# EAGLE design APDS-Breakout (EAGLE 7.2.0)
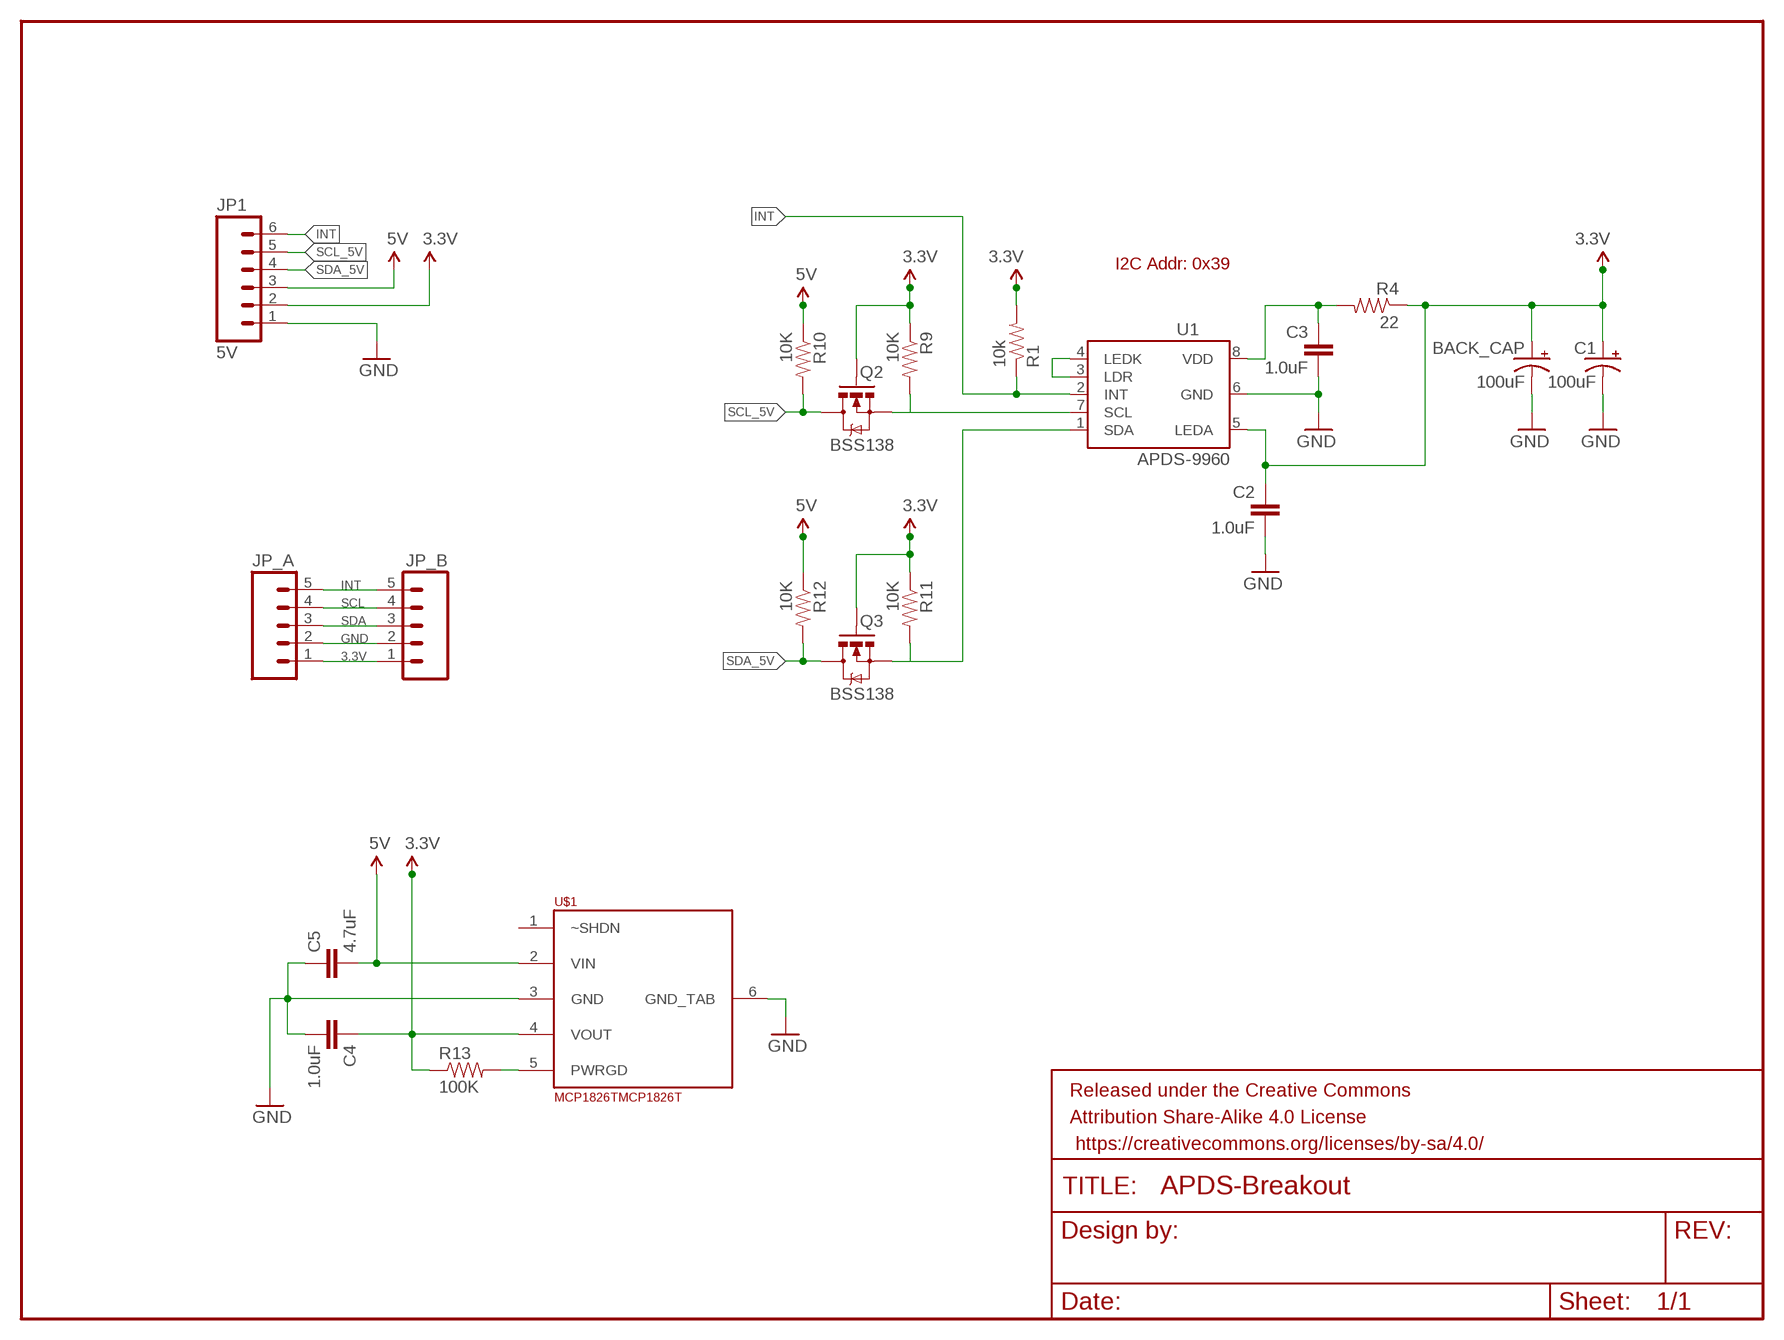
[diagram p0: schematic, sheet 1]

## Parts
BACK_CAP  100uF  100UF-10V-10%(TANT)  [EIA7343]
C1  100uF  100UF-10V-10%(TANT)  [EIA7343]
C2  1.0uF  1.0UF-16V-10%(0603)  [0603-CAP]
C3  1.0uF  1.0UF-16V-10%(0603)  [0603-CAP]
C4  1.0uF  1.0UF-16V-10%(0603)  [0603-CAP]
C5  4.7uF  1.0UF-16V-10%(0603)  [0603-CAP]
FRAME1  FRAME-LETTER  [CREATIVE_COMMONS]
JP1  5V  M06NO_SILK_FEMALE_PTH  [1X06_NO_SILK]
JP_A  M05PTH  [1X05]
JP_B  M05PTH  [1X05]
Q2  BSS138  MOSFET-NCHANNELSMD  [SOT23-3]
Q3  BSS138  MOSFET-NCHANNELSMD  [SOT23-3]
R1  10k  10KOHM1/10W1%(0603)0603  [0603-RES]
R4  22  RESISTOR0603  [0603-RES]
R9  10K  RESISTOR0603-RES  [0603-RES]
R10  10K  RESISTOR0603-RES  [0603-RES]
R11  10K  RESISTOR0603-RES  [0603-RES]
R12  10K  RESISTOR0603-RES  [0603-RES]
R13  100K  RESISTOR0603-RES  [0603-RES]
U1  APDS-9960  [APDS-9960]
U$1  MCP1826TMCP1826T  [SOP-223-5]

## Nets
3.3V: BACK_CAP.A(+) C1.A(+) C2.1 C4.1 JP1.2 JP_A.1 JP_B.1 Q2.1(G) Q3.1(G) R1.2 R4.1 R9.1 R11.1 R13.1 U1.5(LEDA) U$1.4(VOUT)
5V: C5.2 JP1.3 R10.1 R12.1 U$1.2(VIN)
GND: BACK_CAP.C(-) C1.C(-) C2.2 C3.2 C4.2 C5.1 JP1.1 JP_A.2 JP_B.2 U1.6(GND) U$1.3(GND) U$1.6(GND_TAB)
INT: JP1.6 JP_A.5 JP_B.5 R1.1 U1.2(INT)
N$1: C3.1 R4.2 U1.8(VDD)
N$4: U1.3(LDR) U1.4(LEDK)
N$6: R13.2 U$1.5(PWRGD)
SCL: JP_A.4 JP_B.4 Q2.2(S) R9.2 U1.7(SCL)
SCL_5V: JP1.5 Q2.3(D) R10.2
SDA: JP_A.3 JP_B.3 Q3.2(S) R11.2 U1.1(SDA)
SDA_5V: JP1.4 Q3.3(D) R12.2
Unconnected: U$1.1(~SHDN)

## Notes on the sheet
- I2C Addr: 0x39

## Library data of the parts
BACK_CAP C1 = SparkFun-Capacitors:100UF-10V-10%(TANT): CAP-07890; PROD_ID: CAP-07890
C2-C4 = SparkFun-Capacitors:1.0UF-16V-10%(0603): CAP-00868; PROD_ID: CAP-00868
C5 = SparkFun-Capacitors:1.0UF-16V-10%(0603): CAP-00868; PROD_ID: CAP-00868; VALUE: 1.0uF
FRAME1 = SparkFun-Aesthetics:FRAME-LETTER: Schematic Frame Standard 8.5x11 US Letter frame
JP1 = SparkFun-Connectors:M06: Header 6 Standard 6-pin 0.1" header. Use with straight break away headers (SKU : PRT-00116), right angle break away headers (PRT-00553), swiss pins (PRT-00743), machine pins (PRT-00117), and female headers (PRT-00115). Molex polarized connector foot print use with SKU : PRT-08094 with associated crimp pins and housings. NOTES ON THE VARIANTS LOCK and LOCK_LONGPADS... This footprint was designed to help hold the alignment of a through-hole component (i.e. 6-pin header) while soldering it into place. You may notice that each hole has been shifted either up or down by 0.005 of an inch from it's more standard position (which is a perfectly straight line). This slight alteration caused the pins (the squares in the middle) to touch the edges of the holes. Because they are alternating, it causes a "brace" to hold the component in place. 0.005 has proven to be the perfect amount of "off-center" position when using our standard breakaway headers. Although looks a little odd when you look at the bare footprint, once you have a header in there, the alteration is very hard to notice. Also,if you push a header all the way into place, it is covered up entirely on the bottom side. This idea of altering the position of holes to aid alignment will be further integrated into the Sparkfun Library for other footprints. It can help hold any component with 3 or more connection pins.; PROD_ID: CONN-08437
JP_A JP_B = SparkFun-Connectors:M05: Header 5 Standard 5-pin 0.1" header. Use with straight break away headers (SKU : PRT-00116), right angle break away headers (PRT-00553), swiss pins (PRT-00743), machine pins (PRT-00117), and female headers (PRT-00115). Molex polarized connector foot print use with SKU : PRT-08230 with associated crimp pins and housings.
Q2 Q3 = SparkFun:MOSFET-NCHANNEL
R1 = SparkFun-Resistors:10KOHM1/10W1%(0603): RES-00824; PROD_ID: RES-00824; VALUE: 10K
R4 = SparkFun-Resistors:RESISTOR: Resistor Basic schematic elements and footprints for 0603, 1206, and PTH resistors.
R9-R13 = SparkFun:RESISTOR: Resistor Basic schematic elements and footprints for 0603, 1206, and PTH resistors.
U1 = SparkFun-Sensors:APDS-9960: Avago APDS-9960 digital proximity, ambient light, RGB, and gesture sensor.; PROD_ID: SEN-12005
U$1 = ATK_lib:MCP1826T

## Board
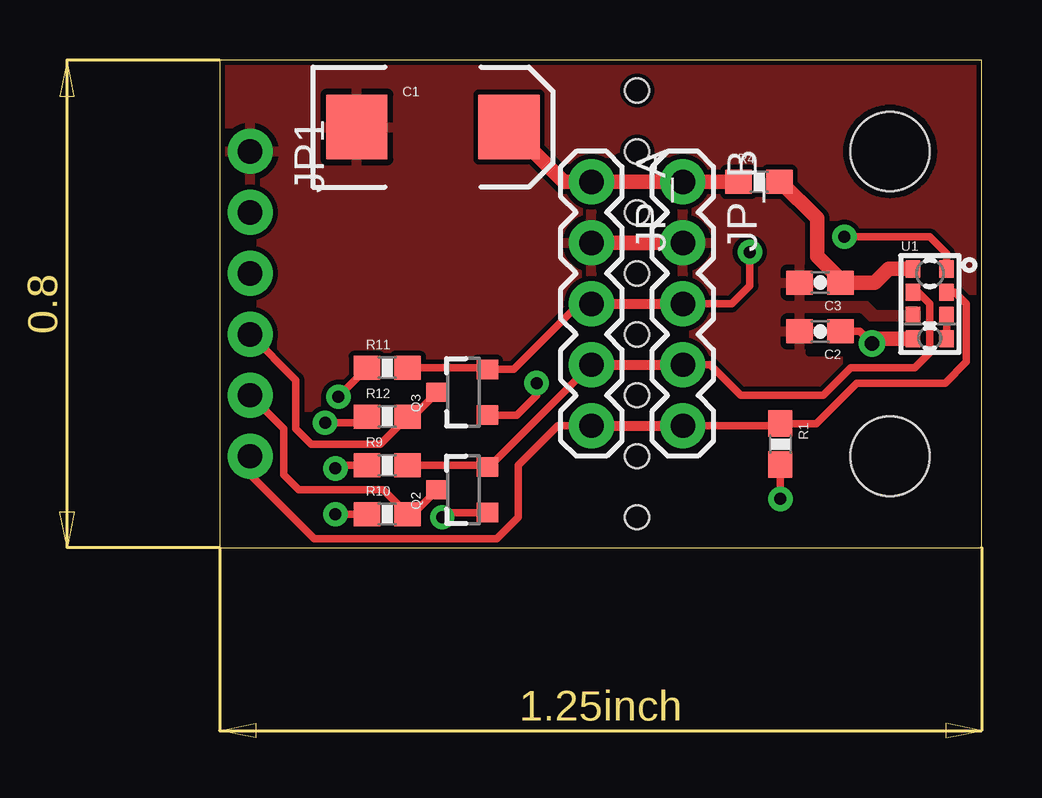
[diagram p1: board, top side]
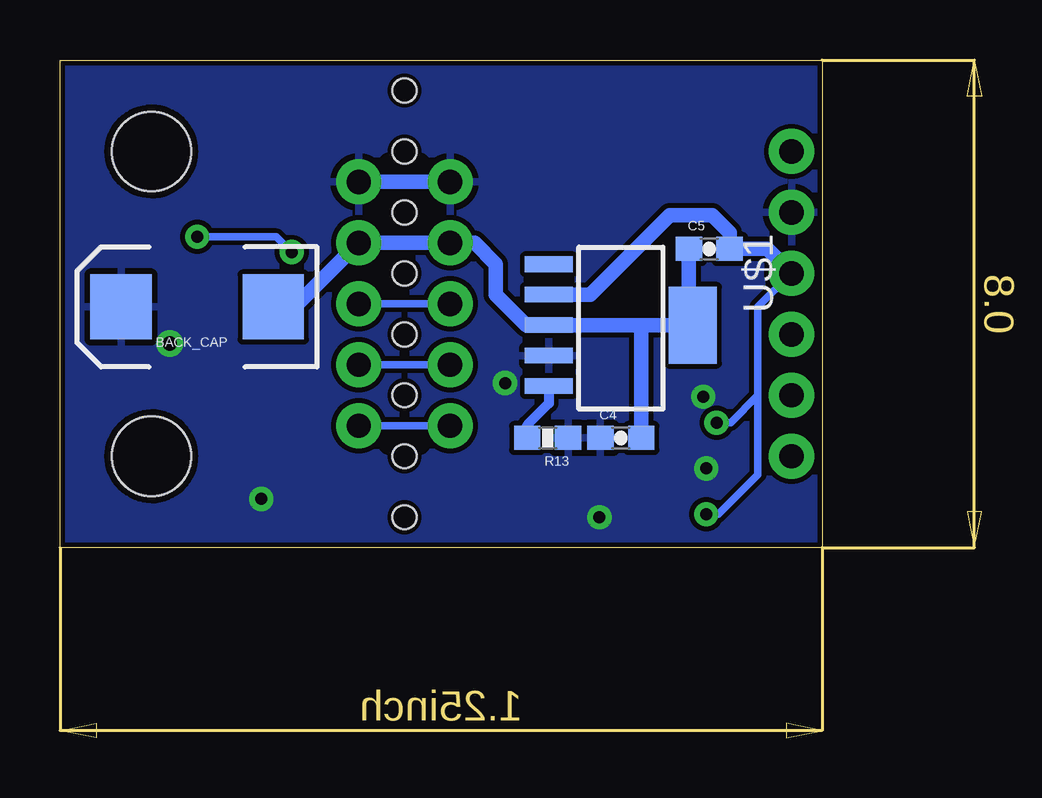
[diagram p2: board, bottom side, seen from below]

Size 31.75 x 20.32 mm. Coordinates in mm from the lower left corner, seen from the top.
Outline: 0,20.31 0,0 31.75,0 31.75,20.32 0,20.32
Copper layers (1*16): Top 0.035mm / dielectric 1.5mm / Bottom 0.035mm
Design rules "SparkFun-2-layer": minimum track width 7mil, minimum drill 15mil, track to track 8mil, track to pad 8mil, pad to pad 8mil, via to via 8mil, smd to smd 8mil, copper to edge 8mil, drill to drill 8mil, minimum pad ring 12mil, minimum via ring 10mil, stop-mask expansion 4mil, vias tented up to drill 20mil, thermal gap 10mil
Holes 1 mm at 17.4,13.97 17.4,11.43 17.4,8.89 17.4,6.35 17.4,16.51 17.4,19.05 17.4,3.81 17.4,1.27
tRestrict: 11 lines
bRestrict: 3 lines

### Footprints (pad centres in the part's own frame; a part is rotated, then mirrored left to right if it is on the bottom)
EIA7343 = smd 2.55 x 2.7: A 3.17,0; C -3.17,0
0603-CAP = smd 1.1 x 1: 1 -0.85,0; 2 0.85,0
1X06_NO_SILK = drill 1.016 pad 1.88: 1 0,0; 2 2.54,0; 3 5.08,0; 4 7.62,0; 5 10.16,0; 6 12.7,0
1X05 = drill 1.016 pad 1.88: 1 0,0; 2 2.54,0; 3 5.08,0; 4 7.62,0; 5 10.16,0
SOT23-3 = smd 0.8 x 0.9: 1 -0.95,-1; 2 0.95,-1; 3 0,1.1
0603-RES = smd 1.1 x 1: 1 -0.85,0; 2 0.85,0
APDS-9960 = smd 0.6 x 0.72: 1 0.7,1.455; 2 0.7,0.485; 3 0.7,-0.485; 4 0.7,-1.455; 5 -0.7,-1.455; 6 -0.7,-0.485; 7 -0.7,0.485; 8 -0.7,1.455
SOP-223-5 = smd 0.65 x 2: 1 -2.54,-3; 2 -1.27,-3; 3 0,-3; 4 1.27,-3; 5 2.54,-3 | smd 3.2 x 2: 6 0,3
STAND-OFF = hole 3.302: 0,0

### Placement (x,y rotation side)
BACK_CAP  26.04,10.03 180 bottom
C1  8.89,17.53 0 top
C2  25.02,9.02 180 top
C3  25.02,11.05 180 top
C4  8.38,4.57 0 bottom
C5  4.7,12.45 0 bottom
FRAME1  -78.74,1.27 0 top  (outside the outline)
JP1  1.27,16.51 270 top
JP_A  15.49,15.24 270 top
JP_B  19.3,15.24 270 top
Q2  10.16,2.41 90 top
Q3  10.16,6.48 90 top
R1  23.37,4.32 270 top
R4  22.48,15.24 0 top
R9  6.99,3.43 0 top
R10  6.99,1.4 0 top
R11  6.99,7.49 0 top
R12  6.99,5.46 0 top
R13  11.43,4.57 180 bottom
U1  29.59,10.16 0 top
U$1  8.38,9.27 270 bottom
U$2  [STAND-OFF]  27.94,16.51 0 top
U$3  [STAND-OFF]  27.94,3.81 0 top

### Tracks (layer width: path | path; a pad name or v marks a point on that pad's centre or on a via)
3.3V  (via drill 0.5, 0.6)
  Top 0.305: Q3.1 12.38,5.53 13.21,6.35 v13.21,6.86 | Q2.1 9.46,1.46 v9.27,1.27 | R1.2 v23.37,2.03 | C2.1 26.67,9.02 v27.18,8.51 | R9.1 4.95,3.43 v4.83,3.3 | R11.1 6.13,7.47 v4.95,6.29
  Top 0.61: R4.1 JP_B.1 JP_A.1 14.35,15.24 C1.A | U1.5 27.37,8.71 v27.18,8.51
  Bottom 0.61: JP_A.1 JP_B.1
  pour Bottom: 0,0 0,80.01 100.33,80.01 100.33,0
5V  (via drill 0.5)
  Top 0.305: v4.83,1.4 R10.1 | v4.39,5.21 5.88,5.21 R12.1
  Bottom 0.305: 2.67,6.35 2.67,3.05 4.32,1.4 v4.83,1.4 | v4.39,5.21 3.81,5.21 2.67,6.35 | 2.67,6.35 2.67,10.03 JP1.3
  Bottom 0.61: U$1.2 9.65,10.54 6.35,13.84 4.57,13.84 3.85,13.12 C5.2 2.29,12.45 JP1.3
GND
  Top 0.61: JP_A.2 JP_B.2
  Bottom 0.61: BACK_CAP.C 21.97,10.03 JP_B.2 JP_A.2 14.48,12.7 13.59,11.81 13.59,10.54 12.32,9.27 U$1.3 7.37,9.27 | 7.37,9.27 U$1.6 5.55,9.44 C5.1 | C4.2 7.53,9.11 7.37,9.27
  pour Top: 0,0 100.33,0 100.33,80.01 0,80.01
INT
  Top 0.305: JP1.6 1.27,3.05 3.94,0.38 11.56,0.38 12.45,1.27 12.45,3.43 14.1,5.08 JP_A.5 15.49,4.95 | JP_B.5 23.28,5.08 R1.1 24.85,5.17 26.54,6.86 30.23,6.86 31.11,7.75 31.11,10.16 30.63,10.64 U1.2
  Top 0.406: JP_A.5 JP_B.5
  Bottom 0.305: JP_A.5 JP_B.5
N$1
  Top 0.61: U1.8 27.87,11.62 27.3,11.05 C3.1 25.87,11.18 24.89,12.15 24.89,13.72 23.37,15.24 R4.2
N$2
  Bottom 0.305: 15.49,7.62 19.3,7.62
N$4
  Top 0.305: U1.3 U1.4
N$6
  Bottom 0.406: U$1.5 11.38,6.02 12.28,5.12 R13.2
SCL
  Top 0.305: R9.2 11.09,3.43 Q2.2 11.24,3.36 JP_A.4 | U1.7 29.11,10.64 29.59,10.16 29.59,8.13 28.96,7.49 26.29,7.49 25.15,6.35 21.72,6.35 20.45,7.62 JP_B.4
  Top 0.406: JP_A.4 JP_B.4
SCL_5V
  Top 0.305: Q2.3 8.04,1.4 R10.2 6.82,2.41 3.3,2.41 2.67,3.05 2.67,4.95 JP1.5
SDA  (via drill 0.5)
  Top 0.305: JP_B.3 21.34,10.16 22.1,10.92 v22.1,12.32 | v26.04,12.95 29.59,12.95 30.29,12.25 U1.1 | JP_A.3 14.99,10.16 12.25,7.43 Q3.2 11.09,7.49 R11.2
  Top 0.406: JP_A.3 JP_B.3
  Bottom 0.305: v22.1,12.32 22.73,12.95 v26.04,12.95 | JP_A.3 JP_B.3
SDA_5V
  Top 0.305: Q3.3 8.04,5.46 R12.2 6.69,4.32 3.81,4.32 3.17,4.95 3.17,6.99 JP1.4

### Text on the board
tDocu: 3.3V | 3.3V | GND | 3.3V | GND | GND | 5V | SDA | SDA | SDA | SCL | SCL | SCL | INT | INT | INT